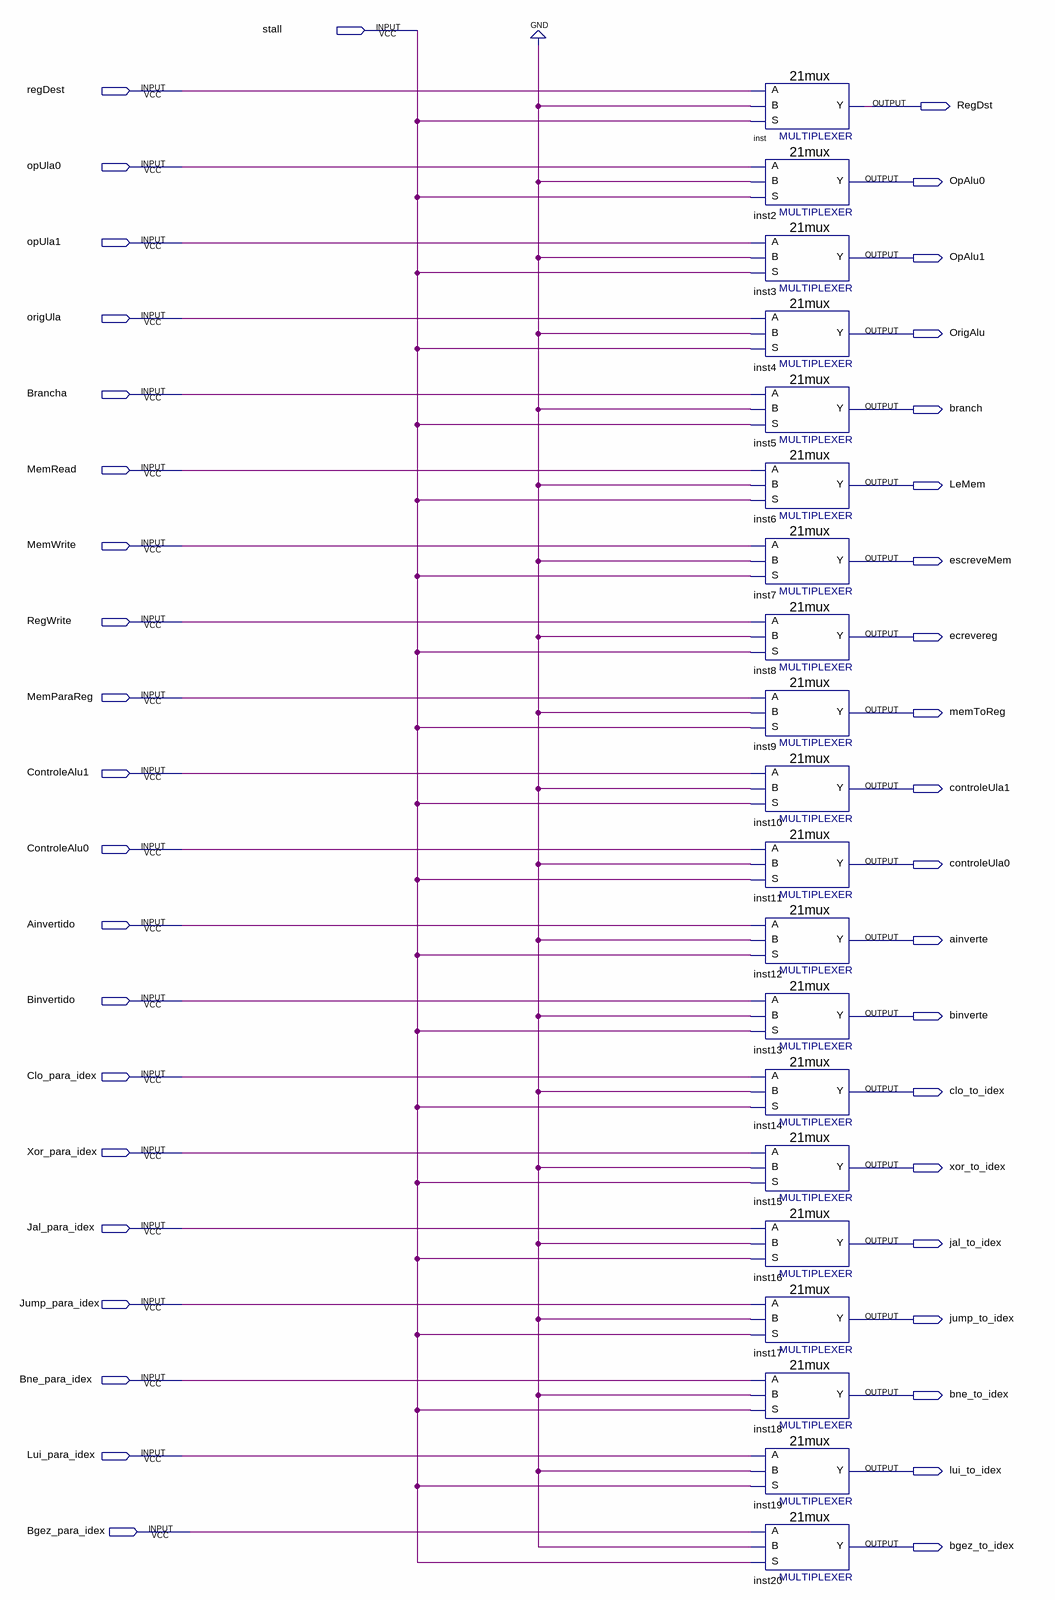
[diagram p0: schematic sheet]
// Quartus schematic stall_mux.bdf as structural Verilog: 20 symbols, 41 pins
module stall_mux (
  input  stall,
  input  regDest,
  input  opUla0,
  input  opUla1,
  input  origUla,
  input  Brancha,
  input  MemRead,
  input  MemWrite,
  input  RegWrite,
  input  MemParaReg,
  input  ControleAlu1,
  input  ControleAlu0,
  input  Ainvertido,
  input  Binvertido,
  input  Clo_para_idex,
  input  Xor_para_idex,
  input  Jal_para_idex,
  input  Jump_para_idex,
  input  Bne_para_idex,
  input  Lui_para_idex,
  input  Bgez_para_idex,
  output RegDst,
  output OpAlu0,
  output OpAlu1,
  output OrigAlu,
  output branch,
  output LeMem,
  output escreveMem,
  output ecrevereg,
  output memToReg,
  output controleUla1,
  output controleUla0,
  output ainverte,
  output binverte,
  output clo_to_idex,
  output xor_to_idex,
  output jal_to_idex,
  output jump_to_idex,
  output bne_to_idex,
  output lui_to_idex,
  output bgez_to_idex
);

  \21mux  inst (.S(stall), .B(1'b0), .A(regDest), .Y(RegDst));
  \21mux  inst2 (.S(stall), .B(1'b0), .A(opUla0), .Y(OpAlu0));
  \21mux  inst3 (.S(stall), .B(1'b0), .A(opUla1), .Y(OpAlu1));
  \21mux  inst4 (.S(stall), .B(1'b0), .A(origUla), .Y(OrigAlu));
  \21mux  inst5 (.S(stall), .B(1'b0), .A(Brancha), .Y(branch));
  \21mux  inst6 (.S(stall), .B(1'b0), .A(MemRead), .Y(LeMem));
  \21mux  inst7 (.S(stall), .B(1'b0), .A(MemWrite), .Y(escreveMem));
  \21mux  inst8 (.S(stall), .B(1'b0), .A(RegWrite), .Y(ecrevereg));
  \21mux  inst9 (.S(stall), .B(1'b0), .A(MemParaReg), .Y(memToReg));
  \21mux  inst10 (.S(stall), .B(1'b0), .A(ControleAlu1), .Y(controleUla1));
  \21mux  inst11 (.S(stall), .B(1'b0), .A(ControleAlu0), .Y(controleUla0));
  \21mux  inst12 (.S(stall), .B(1'b0), .A(Ainvertido), .Y(ainverte));
  \21mux  inst13 (.S(stall), .B(1'b0), .A(Binvertido), .Y(binverte));
  \21mux  inst14 (.S(stall), .B(1'b0), .A(Clo_para_idex), .Y(clo_to_idex));
  \21mux  inst15 (.S(stall), .B(1'b0), .A(Xor_para_idex), .Y(xor_to_idex));
  \21mux  inst16 (.S(stall), .B(1'b0), .A(Jal_para_idex), .Y(jal_to_idex));
  \21mux  inst17 (.S(stall), .B(1'b0), .A(Jump_para_idex), .Y(jump_to_idex));
  \21mux  inst18 (.S(stall), .B(1'b0), .A(Bne_para_idex), .Y(bne_to_idex));
  \21mux  inst19 (.S(stall), .B(1'b0), .A(Lui_para_idex), .Y(lui_to_idex));
  \21mux  inst20 (.S(stall), .B(1'b0), .A(Bgez_para_idex), .Y(bgez_to_idex));
endmodule
